# EAGLE schematic mainboard (EAGLE 9.6.2)
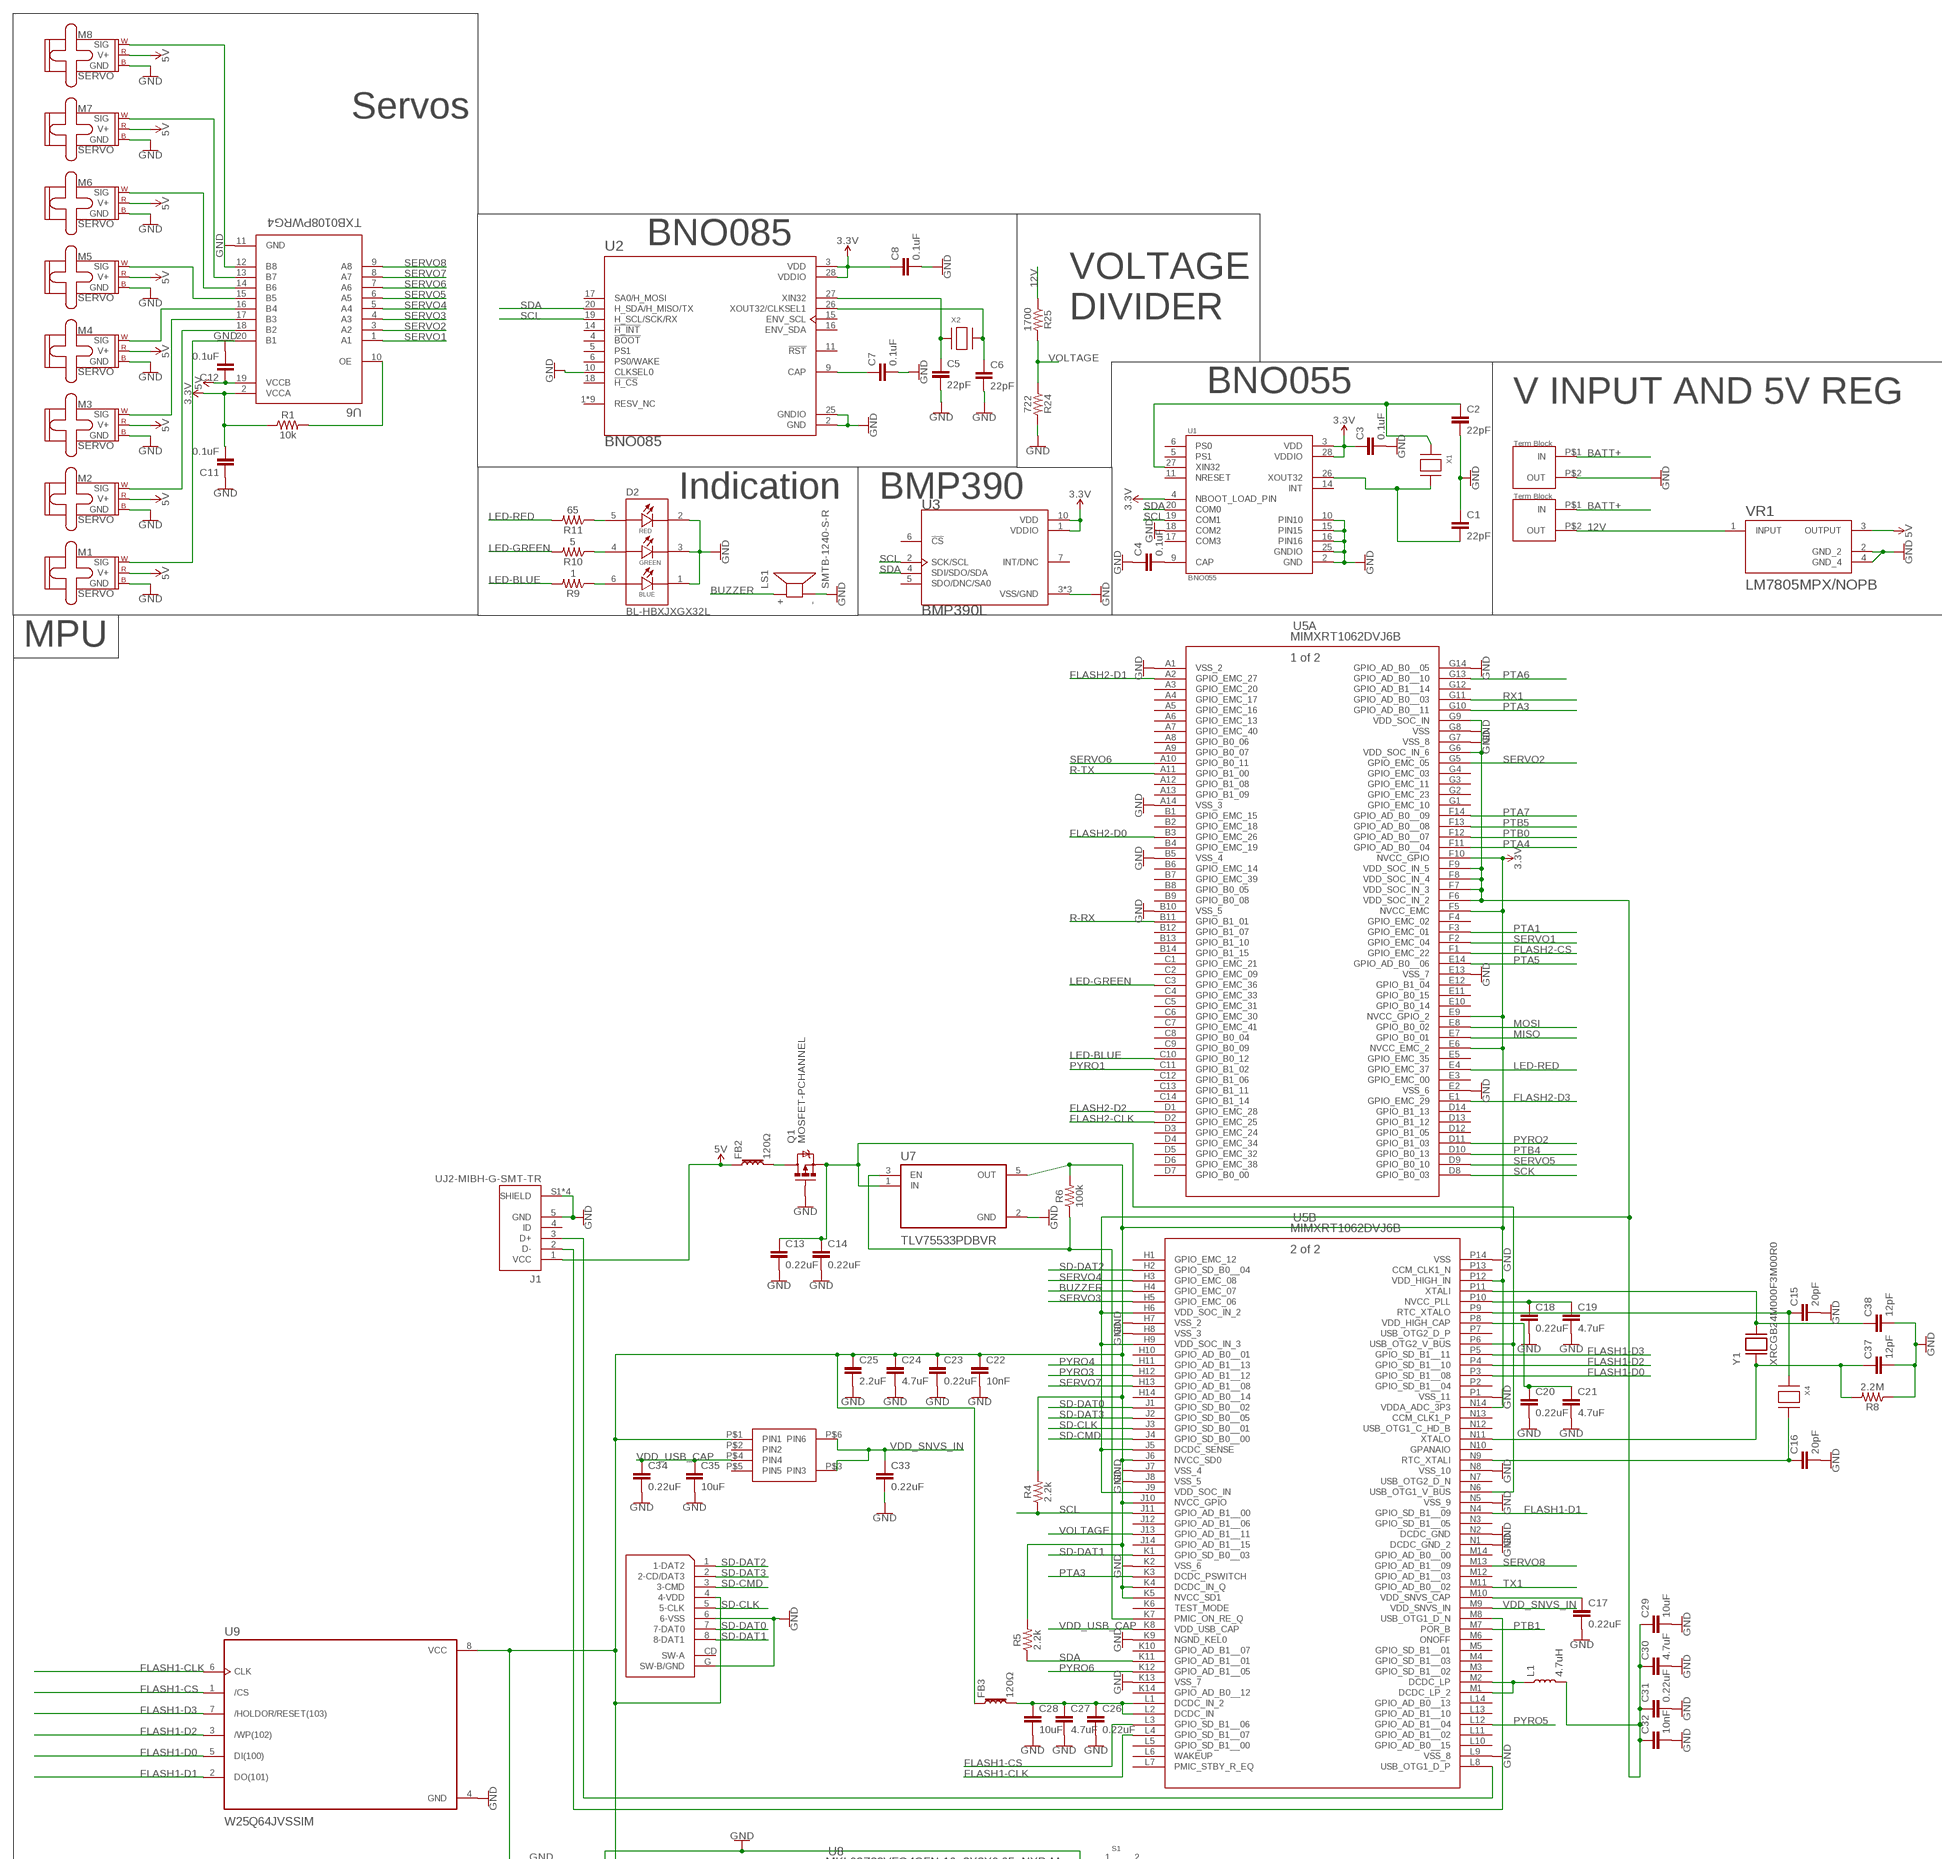
[diagram p0: schematic, sheet 1, part 1 of 3]
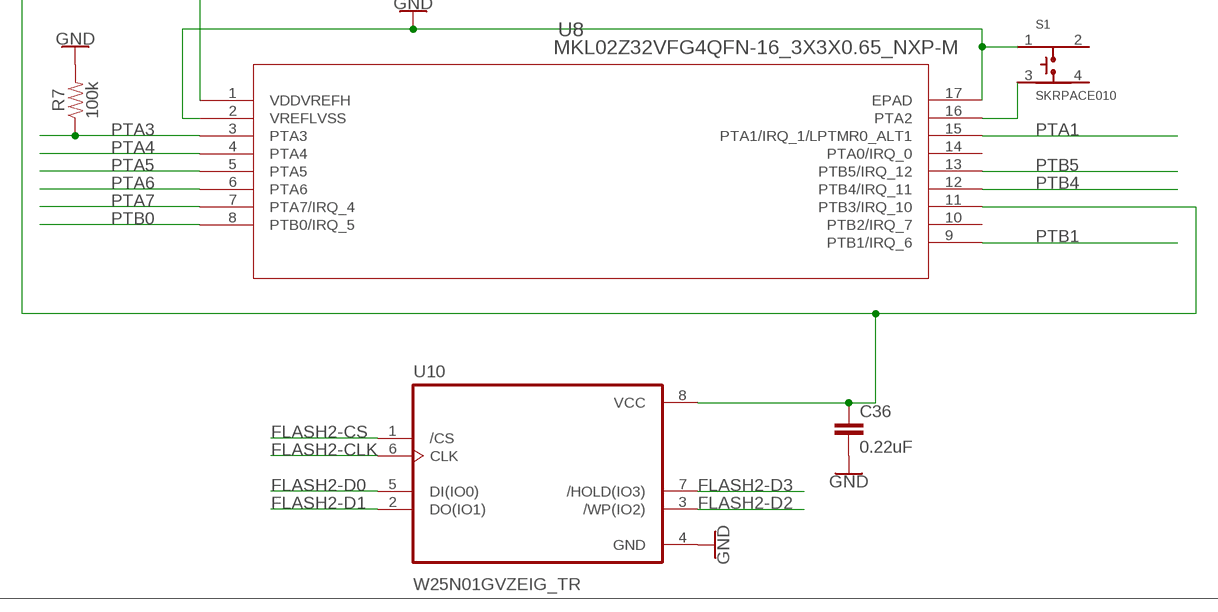
[diagram p1: schematic, sheet 1, part 2 of 3]
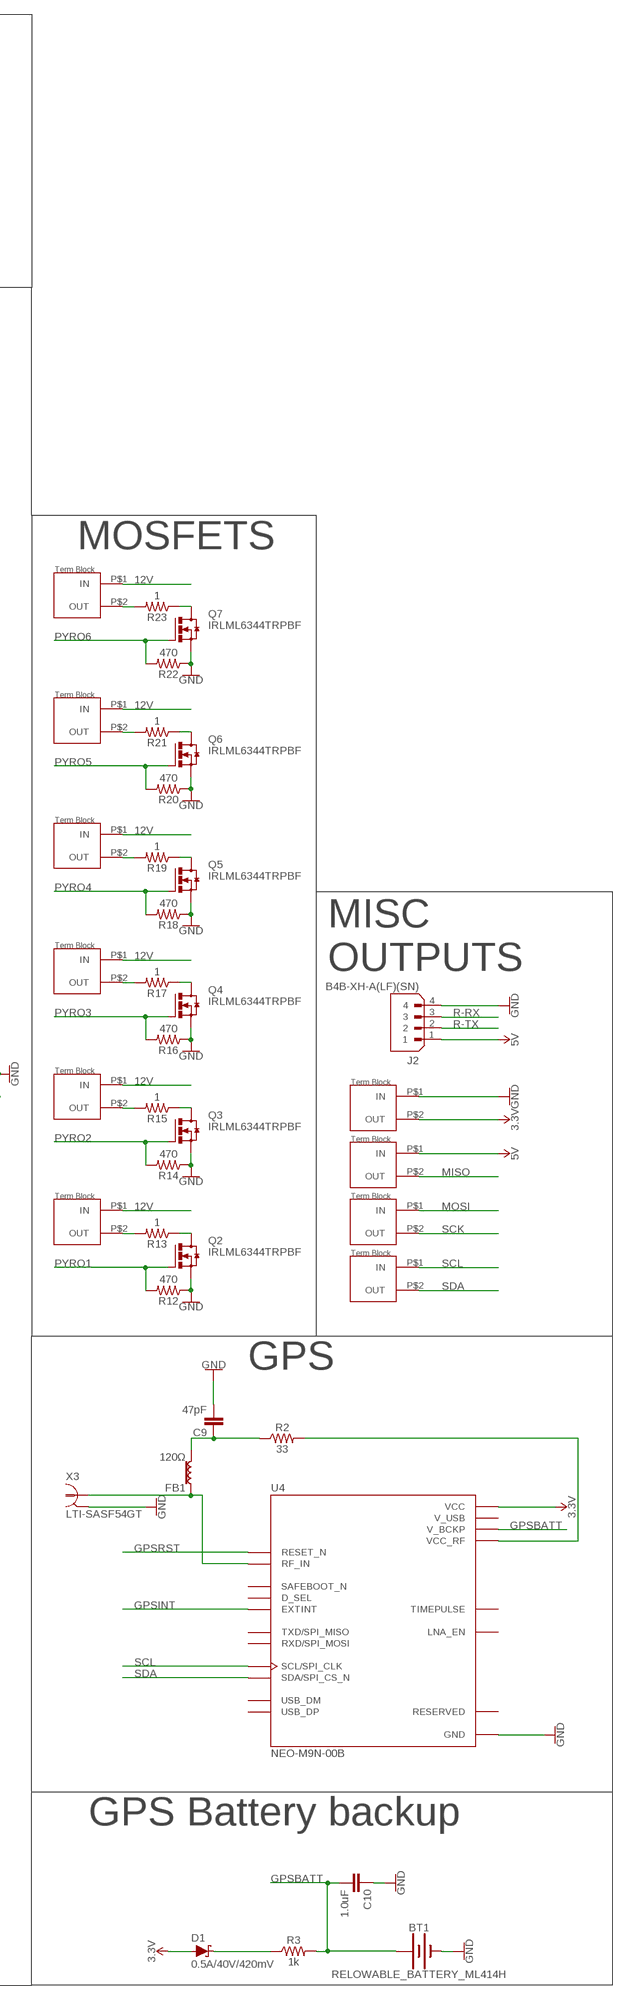
[diagram p2: schematic, sheet 1, part 3 of 3]

## Parts
BT1  RELOWABLE_BATTERY_ML414H  [ML414H_IV01E]
C1  22pF  1.0UF-0805-25V-10%  [0805]
C2  22pF  1.0UF-0805-25V-10%  [0805]
C3  0.1uF  1.0UF-0805-25V-10%  [0805]
C4  0.1uF  1.0UF-0805-25V-10%  [0805]
C5  22pF  1.0UF-0805-25V-10%  [0805]
C6  22pF  1.0UF-0805-25V-10%  [0805]
C7  0.1uF  1.0UF-0805-25V-10%  [0805]
C8  0.1uF  1.0UF-0805-25V-10%  [0805]
C9  47pF  1.0UF-0805-25V-10%  [0805]
C10  1.0uF  1.0UF-0805-25V-10%  [0805]
C11  0.1uF  1.0UF-0805-25V-10%  [0805]
C12  0.1uF  1.0UF-0805-25V-10%  [0805]
C13  0.22uF  1.0UF-0805-25V-10%  [0805]
C14  0.22uF  1.0UF-0805-25V-10%  [0805]
C15  20pF  1.0UF-0805-25V-10%  [0805]
C16  20pF  1.0UF-0805-25V-10%  [0805]
C17  0.22uF  1.0UF-0805-25V-10%  [0805]
C18  0.22uF  1.0UF-0805-25V-10%  [0805]
C19  4.7uF  1.0UF-0805-25V-10%  [0805]
C20  0.22uF  1.0UF-0805-25V-10%  [0805]
C21  4.7uF  1.0UF-0805-25V-10%  [0805]
C22  10nF  1.0UF-0805-25V-10%  [0805]
C23  0.22uF  1.0UF-0805-25V-10%  [0805]
C24  4.7uF  1.0UF-0805-25V-10%  [0805]
C25  2.2uF  1.0UF-0805-25V-10%  [0805]
C26  0.22uF  1.0UF-0805-25V-10%  [0805]
C27  4.7uF  1.0UF-0805-25V-10%  [0805]
C28  10uF  1.0UF-0805-25V-10%  [0805]
C29  10uF  1.0UF-0805-25V-10%  [0805]
C30  4.7uF  1.0UF-0805-25V-10%  [0805]
C31  0.22uF  1.0UF-0805-25V-10%  [0805]
C32  10nF  1.0UF-0805-25V-10%  [0805]
C33  0.22uF  1.0UF-0805-25V-10%  [0805]
C34  0.22uF  1.0UF-0805-25V-10%  [0805]
C35  10uF  1.0UF-0805-25V-10%  [0805]
C36  0.22uF  1.0UF-0805-25V-10%  [0805]
C37  12pF  1.0UF-0805-25V-10%  [0805]
C38  12pF  1.0UF-0805-25V-10%  [0805]
D1  0.5A/40V/420mV  DIODE-SCHOTTKY-PMEG4005EJ  [SOD-323]
D2  BL-HBXJXGX32L  [LED_BL-HBXJXGX32L]
FB1  120Ω  FERRITE_BEAD-0805-220Ω-100MHZ-2A  [0805]
FB2  120Ω  FERRITE_BEAD-0805-220Ω-100MHZ-2A  [0805]
FB3  120Ω  FERRITE_BEAD-0805-220Ω-100MHZ-2A  [0805]
J1  UJ2-MIBH-G-SMT-TR  [CUI_UJ2-MIBH-G-SMT-TR]
J2  B4B-XH-A(LF)(SN)  [JST_B4B-XH-A(LF)(SN)]
K1  112J-TDAR-R01  [112J-TDAR-R01]
L1  4.7uH  INDUCTOR-0805_WIDE-2.2UH  [0805-WIDE]
LS1  SMTB-1240-S-R  [XDCR_SMTB-1240-S-R]
M1  SERVO  [1X03]
M2  SERVO  [1X03]
M3  SERVO  [1X03]
M4  SERVO  [1X03]
M5  SERVO  [1X03]
M6  SERVO  [1X03]
M7  SERVO  [1X03]
M8  SERVO  [1X03]
Q1  MOSFET-PCHANNEL  [SOT23-3]
Q2  IRLML6344TRPBF  [SOT23]
Q3  IRLML6344TRPBF  [SOT23]
Q4  IRLML6344TRPBF  [SOT23]
Q5  IRLML6344TRPBF  [SOT23]
Q6  IRLML6344TRPBF  [SOT23]
Q7  IRLML6344TRPBF  [SOT23]
R1  10k  0.3OHM-0805-1/8W-1%  [0805]
R2  33  0.3OHM-0805-1/8W-1%  [0805]
R3  1k  0.3OHM-0805-1/8W-1%  [0805]
R4  2.2k  0.3OHM-0805-1/8W-1%  [0805]
R5  2.2k  0.3OHM-0805-1/8W-1%  [0805]
R6  100k  0.3OHM-0805-1/8W-1%  [0805]
R7  100k  0.3OHM-0805-1/8W-1%  [0805]
R8  2.2M  0.3OHM-0805-1/8W-1%  [0805]
R9  1  0.3OHM-0805-1/8W-1%  [0805]
R10  5  0.3OHM-0805-1/8W-1%  [0805]
R11  65  0.3OHM-0805-1/8W-1%  [0805]
R12  470  0.3OHM-0805-1/8W-1%  [0805]
R13  1  0.3OHM-0805-1/8W-1%  [0805]
R14  470  0.3OHM-0805-1/8W-1%  [0805]
R15  1  0.3OHM-0805-1/8W-1%  [0805]
R16  470  0.3OHM-0805-1/8W-1%  [0805]
R17  1  0.3OHM-0805-1/8W-1%  [0805]
R18  470  0.3OHM-0805-1/8W-1%  [0805]
R19  1  0.3OHM-0805-1/8W-1%  [0805]
R20  470  0.3OHM-0805-1/8W-1%  [0805]
R21  1  0.3OHM-0805-1/8W-1%  [0805]
R22  470  0.3OHM-0805-1/8W-1%  [0805]
R23  1  0.3OHM-0805-1/8W-1%  [0805]
R24  722  0.3OHM-0805-1/8W-1%  [0805]
R25  1700  0.3OHM-0805-1/8W-1%  [0805]
S1  SKRPACE010  [SW_SKRPACE010]
U1  BNO055  [LGA28R50P4X10_380X520X100]
U2  BNO085  [IC_BNO085]
U3  BMP390L  [XDCR_BMP390L]
U4  NEO-M9N-00B  [XCVR_NEO-M9N-00B]
U5  MIMXRT1062DVJ6B  [BGA196_MIMXRT_NXP]
U6  TXB0108PWRG4  [SOP65P640X120-20N]
U7  TLV75533PDBVR  [SOT95P280X145-5N]
U8  MKL02Z32VFG4QFN-16_3X3X0.65_NXP-M  [QFN-16_3X3X0.65_NXP-M]
U9  W25Q64JVSSIM  [SOIC127P790X216-8N]
U10  W25N01GVZEIG_TR  [SON127P800X600X80-9N]
U$1  BAT54CTB6  [BAT54CTB6]
U$2  AK100  [AK100]
U$3  AK100  [AK100]
U$4  AK100  [AK100]
U$5  AK100  [AK100]
U$6  AK100  [AK100]
U$7  AK100  [AK100]
U$8  AK100  [AK100]
U$9  AK100  [AK100]
U$10  AK100  [AK100]
U$11  AK100  [AK100]
U$12  AK100  [AK100]
U$13  AK100  [AK100]
VR1  LM7805MPX/NOPB  [VREG_LM7805MPX/NOPB]
X1  XTAL-3.2X1.5  [XTAL3215]
X2  XTAL-3.2X1.5  [XTAL3215]
X3  LTI-SASF54GT  [LTI-SASF54GT]
X4  XTAL-3.2X1.5  [XTAL3215]
Y1  XRCGB24M000F3M00R0  [OSC_XRCGB24M000F3M00R0]

## Nets
3.3V: C3.1 C8.1 C11.2 C22.1 C23.1 C24.1 C25.1 C36.1 D1.A FB3.1 K1.4(4-VDD) R1.1 R4.2 R5.2 R6.2 U1.3(VDD) U1.4(NBOOT_LOAD_PIN) U1.28(VDDIO) U2.3(VDD) U2.28(VDDIO) U3.1(VDDIO) U3.10(VDD) U4.23(VCC) U5.E6(A:NVCC_EMC_2) U5.E9(A:NVCC_GPIO_2) U5.F5(A:NVCC_EMC) U5.F10(A:NVCC_GPIO) U5.J6(B:NVCC_SD0) U5.J10(B:NVCC_GPIO) U5.K4(B:DCDC_IN_Q) U5.K5(B:NVCC_SD1) U5.N14(B:VDDA_ADC_3P3) U5.P12(B:VDD_HIGH_IN) U6.2(VCCA) U7.5(OUT) U8.1(VDDVREFH) U8.11(PTB3/IRQ_10) U9.8(VCC) U10.8(VCC) U$1.P$1(PIN1) U$11.P$2(OUT)
5V: C12.1 FB2.1 J1.1(VCC) J2.1 M1.2(V+) M2.2(V+) M3.2(V+) M4.2(V+) M5.2(V+) M6.2(V+) M7.2(V+) M8.2(V+) U6.19(VCCB) U$10.P$1(IN) VR1.3(OUTPUT)
12V: R25.1 U$2.P$1(IN) U$3.P$1(IN) U$4.P$1(IN) U$5.P$1(IN) U$6.P$1(IN) U$8.P$1(IN) U$13.P$2(OUT) VR1.1(INPUT)
BATT+: U$12.P$1(IN) U$13.P$1(IN)
BUZZER: LS1.P(+) U5.H4(B:GPIO_EMC_07)
FLASH1-CLK: U5.L4(B:GPIO_SD_B1__07) U9.6(CLK)
FLASH1-CS: U5.L3(B:GPIO_SD_B1__06) U9.1(/CS)
FLASH1-D0: U5.P3(B:GPIO_SD_B1__08) U9.5(DI(100))
FLASH1-D1: U5.N4(B:GPIO_SD_B1__09) U9.2(DO(101))
FLASH1-D2: U5.P4(B:GPIO_SD_B1__10) U9.3(/WP(102))
FLASH1-D3: U5.P5(B:GPIO_SD_B1__11) U9.7(/HOLDOR/RESET(103))
FLASH2-CLK: U5.D2(A:GPIO_EMC_25) U10.6(CLK)
FLASH2-CS: U5.F1(A:GPIO_EMC_22) U10.1(/CS)
FLASH2-D0: U5.B3(A:GPIO_EMC_26) U10.5(DI(IO0))
FLASH2-D1: U5.A2(A:GPIO_EMC_27) U10.2(DO(IO1))
FLASH2-D2: U5.D1(A:GPIO_EMC_28) U10.3(/WP(IO2))
FLASH2-D3: U5.E1(A:GPIO_EMC_29) U10.7(/HOLD(IO3))
GND: BT1.- C1.1 C2.2 C3.2 C4.1 C5.2 C6.2 C7.2 C8.2 C9.2 C10.1 C11.1 C12.2 C13.2 C14.2 C15.2 C16.2 C17.2 C18.2 C19.2 C20.2 C21.2 C22.2 C23.2 C24.2 C25.2 C26.2 C27.2 C28.2 C29.2 C30.2 C31.2 C32.2 C33.2 C34.2 C35.2 C36.2 C37.2 C38.2 D2.1(B_C) D2.2(R_C) D2.3(G_C) J1.5(GND) J1.S1(SHIELD) J1.S2(SHIELD) J1.S3(SHIELD) J1.S4(SHIELD) J2.4 K1.6(6-VSS) K1.G(SW-B/GND) LS1.N(-) M1.3(GND) M2.3(GND) M3.3(GND) M4.3(GND) M5.3(GND) M6.3(GND) M7.3(GND) M8.3(GND) Q1.1(G) Q2.2(S) Q3.2(S) Q4.2(S) Q5.2(S) Q6.2(S) Q7.2(S) R7.2 R8.1 R12.1 R14.1 R16.1 R18.1 R20.1 R22.1 R24.2 S1.1 U1.2(GND) U1.10(PIN10) U1.15(PIN15) U1.16(PIN16) U1.18(COM2) U1.25(GNDIO) U2.2(GND) U2.10(CLKSEL0) U2.25(GNDIO) U3.3(VSS/GND) U3.8(VSS/GND) U3.9(VSS/GND) U4.10(GND) U4.12(GND) U4.13(GND) U4.24(GND) U5.A1(A:VSS_2) U5.A14(A:VSS_3) U5.B5(A:VSS_4) U5.B10(A:VSS_5) U5.E2(A:VSS_6) U5.E13(A:VSS_7) U5.G7(A:VSS_8) U5.G8(A:VSS) U5.G14(A:GPIO_AD_B0__05) U5.H7(B:VSS_2) U5.H8(B:VSS_3) U5.J7(B:VSS_4) U5.J8(B:VSS_5) U5.K2(B:VSS_6) U5.K9(B:NGND_KEL0) U5.K13(B:VSS_7) U5.L9(B:VSS_8) U5.N1(B:DCDC_GND_2) U5.N2(B:DCDC_GND) U5.N5(B:VSS_9) U5.N8(B:VSS_10) U5.P1(B:VSS_11) U5.P14(B:VSS) U6.11(GND) U7.2(GND) U8.2(VREFLVSS) U8.17(EPAD) U9.4(GND) U10.4(GND) U$11.P$1(IN) U$12.P$2(OUT) VR1.2(GND_2) VR1.4(GND_4) X3.2 X3.3 X3.4 X3.5
GPSBATT: BT1.+ C10.2 R3.2 U4.22(V_BCKP)
GPSINT: U4.4(EXTINT)
GPSRST: U4.8(RESET_N)
LED-BLUE: R9.2 U5.C10(A:GPIO_B0_12)
LED-GREEN: R10.2 U5.C3(A:GPIO_EMC_36)
LED-RED: R11.2 U5.E4(A:GPIO_EMC_37)
MISO: U5.E7(A:GPIO_B0_01) U$10.P$2(OUT)
MOSI: U5.E8(A:GPIO_B0_02) U$9.P$1(IN)
N$1: C2.1 U1.27(XIN32) X1.P$1
N$2: C1.2 U1.26(XOUT32) X1.P$2
N$3: C4.2 U1.9(CAP)
N$4: C5.1 U2.27(XIN32) X2.P$1
N$5: C6.1 U2.26(XOUT32/CLKSEL1) X2.P$2
N$6: C7.1 U2.9(CAP)
N$8: FB1.1 U4.11(RF_IN) X3.1
N$9: R2.2 U4.9(VCC_RF)
N$10: C9.1 FB1.2 R2.1
N$11: D1.C R3.1
N$12: C16.1 U5.N9(B:RTC_XTALI) X4.P$2
N$13: R6.1 U5.K7(B:PMIC_ON_RE_Q) U7.3(EN)
N$14: M8.1(SIG) U6.12(B8)
N$15: M7.1(SIG) U6.13(B7)
N$16: M6.1(SIG) U6.14(B6)
N$17: M5.1(SIG) U6.15(B5)
N$18: M1.1(SIG) U6.20(B1)
N$19: M2.1(SIG) U6.18(B2)
N$20: M3.1(SIG) U6.17(B3)
N$21: M4.1(SIG) U6.16(B4)
N$22: R1.2 U6.10(OE)
N$23: J1.2(D-) U5.M8(B:USB_OTG1_D_N)
N$24: J1.3(D+) U5.L8(B:USB_OTG1_D_P)
N$25: FB2.2 Q1.3(D)
N$26: C15.1 U5.P9(B:RTC_XTALO) X4.P$1
N$27: C13.1 C14.1 Q1.2(S) U5.N6(B:USB_OTG1_V_BUS) U5.P6(B:USB_OTG2_V_BUS) U7.1(IN)
N$28: C26.1 C27.1 C28.1 FB3.2 U5.L1(B:DCDC_IN_2) U5.L2(B:DCDC_IN)
N$29: L1.1 U5.M1(B:DCDC_LP_2) U5.M2(B:DCDC_LP)
N$30: C29.1 C30.1 C31.1 C32.1 L1.2 U5.F6(A:VDD_SOC_IN_2) U5.F7(A:VDD_SOC_IN_3) U5.F8(A:VDD_SOC_IN_4) U5.F9(A:VDD_SOC_IN_5) U5.G6(A:VDD_SOC_IN_6) U5.G9(A:VDD_SOC_IN) U5.H6(B:VDD_SOC_IN_2) U5.H9(B:VDD_SOC_IN_3) U5.J5(B:DCDC_SENSE) U5.J9(B:VDD_SOC_IN)
N$31: C17.1 U5.M10(B:VDD_SNVS_CAP)
N$32: C20.1 C21.1 U5.P8(B:VDD_HIGH_CAP)
N$33: C18.1 C19.1 U5.P10(B:NVCC_PLL)
N$34: S1.3 U8.16(PTA2)
N$35: C37.1 R8.2 U5.N11(B:XTALO) Y1.1
N$36: C38.1 U5.P11(B:XTALI) Y1.3
N$37: D2.6(B_A) R9.1
N$38: D2.4(G_A) R10.1
N$39: D2.5(R_A) R11.1
N$41: Q2.3(D) R13.1
N$42: R13.2 U$8.P$2(OUT)
N$44: Q3.3(D) R15.1
N$45: R15.2 U$2.P$2(OUT)
N$47: Q4.3(D) R17.1
N$48: R17.2 U$3.P$2(OUT)
N$50: Q5.3(D) R19.1
N$51: R19.2 U$4.P$2(OUT)
N$53: Q6.3(D) R21.1
N$54: R21.2 U$5.P$2(OUT)
N$56: Q7.3(D) R23.1
N$57: R23.2 U$6.P$2(OUT)
PTA1: U5.F3(A:GPIO_EMC_01) U8.15(PTA1/IRQ_1/LPTMR0_ALT1)
PTA3: R7.1 U5.G10(A:GPIO_AD_B0__11) U5.K3(B:DCDC_PSWITCH) U8.3(PTA3)
PTA4: U5.F11(A:GPIO_AD_B0__04) U8.4(PTA4)
PTA5: U5.E14(A:GPIO_AD_B0__06) U8.5(PTA5)
PTA6: U5.G13(A:GPIO_AD_B0__10) U8.6(PTA6)
PTA7: U5.F14(A:GPIO_AD_B0__09) U8.7(PTA7/IRQ_4)
PTB0: U5.F12(A:GPIO_AD_B0__07) U8.8(PTB0/IRQ_5)
PTB1: U5.M7(B:POR_B) U8.9(PTB1/IRQ_6)
PTB4: U5.D10(A:GPIO_B0_13) U8.12(PTB4/IRQ_11)
PTB5: U5.F13(A:GPIO_AD_B0__08) U8.13(PTB5/IRQ_12)
PYRO1: Q2.1(G) R12.2 U5.C11(A:GPIO_B1_02)
PYRO2: Q3.1(G) R14.2 U5.D11(A:GPIO_B1_03)
PYRO3: Q4.1(G) R16.2 U5.H12(B:GPIO_AD_B1__12)
PYRO4: Q5.1(G) R18.2 U5.H11(B:GPIO_AD_B1__13)
PYRO5: Q6.1(G) R20.2 U5.L12(B:GPIO_AD_B1__04)
PYRO6: Q7.1(G) R22.2 U5.K12(B:GPIO_AD_B1__05)
R-RX: J2.3 U5.B11(A:GPIO_B1_01)
R-TX: J2.2 U5.A11(A:GPIO_B1_00)
RX1: U5.G11(A:GPIO_AD_B0__03)
SCK: U5.D8(A:GPIO_B0_03) U$9.P$2(OUT)
SCL: R4.1 U1.19(COM1) U2.19(H_SCL/SCK/RX) U3.2(SCK/SCL) U4.19(SCL/SPI_CLK) U5.J11(B:GPIO_AD_B1__00) U$7.P$1(IN)
SD-CLK: K1.5(5-CLK) U5.J3(B:GPIO_SD_B0__01)
SD-CMD: K1.3(3-CMD) U5.J4(B:GPIO_SD_B0__00)
SD-DAT0: K1.7(7-DAT0) U5.J1(B:GPIO_SD_B0__02)
SD-DAT1: K1.8(8-DAT1) U5.K1(B:GPIO_SD_B0__03)
SD-DAT2: K1.1(1-DAT2) U5.H2(B:GPIO_SD_B0__04)
SD-DAT3: K1.2(2-CD/DAT3) U5.J2(B:GPIO_SD_B0__05)
SDA: R5.1 U1.20(COM0) U2.20(H_SDA/H_MISO/TX) U3.4(SDI/SDO/SDA) U4.18(SDA/SPI_CS_N) U5.K11(B:GPIO_AD_B1__01) U$7.P$2(OUT)
SERVO1: U5.F2(A:GPIO_EMC_04) U6.1(A1)
SERVO2: U5.G5(A:GPIO_EMC_05) U6.3(A2)
SERVO3: U5.H5(B:GPIO_EMC_06) U6.4(A3)
SERVO4: U5.H3(B:GPIO_EMC_08) U6.5(A4)
SERVO5: U5.D9(A:GPIO_B0_10) U6.6(A5)
SERVO6: U5.A10(A:GPIO_B0_11) U6.7(A6)
SERVO7: U5.H13(B:GPIO_AD_B1__08) U6.8(A7)
SERVO8: U5.M13(B:GPIO_AD_B1__09) U6.9(A8)
TX1: U5.M11(B:GPIO_AD_B0__02)
VDD_SNVS_IN: C33.1 U5.M9(B:VDD_SNVS_IN) U$1.P$3(PIN3) U$1.P$6(PIN6)
VDD_USB_CAP: C34.1 C35.1 U5.K8(B:VDD_USB_CAP) U$1.P$4(PIN4)
VOLTAGE: R24.1 R25.2 U5.J13(B:GPIO_AD_B1__11)
Unconnected: J1.4(ID) K1.CD(SW-A) S1.2 S1.4 U1.5(PS1) U1.6(PS0) U1.11(NRESET) U1.14(INT) U1.17(COM3) U2.1(RESV_NC) U2.4(!BOOT) U2.5(PS1) U2.6(PS0/WAKE) U2.7(RESV_NC) U2.8(RESV_NC) U2.11(!RST) U2.12(RESV_NC) U2.13(RESV_NC) U2.14(!H_INT) U2.15(ENV_SCL) U2.16(ENV_SDA) U2.17(SA0/H_MOSI) U2.18(!H_CS) U2.21(RESV_NC) U2.22(RESV_NC) U2.23(RESV_NC) U2.24(RESV_NC) U3.5(SDO/DNC/SA0) U3.6(!CS) U3.7(INT/DNC) U4.1(SAFEBOOT_N) U4.2(D_SEL) U4.3(TIMEPULSE) U4.5(USB_DM) U4.6(USB_DP) U4.14(LNA_EN) U4.15(RESERVED) U4.16(RESERVED) U4.17(RESERVED) U4.20(TXD/SPI_MISO) U4.21(RXD/SPI_MOSI) U5.A3(A:GPIO_EMC_20) U5.A4(A:GPIO_EMC_17) U5.A5(A:GPIO_EMC_16) U5.A6(A:GPIO_EMC_13) U5.A7(A:GPIO_EMC_40) U5.A8(A:GPIO_B0_06) U5.A9(A:GPIO_B0_07) U5.A12(A:GPIO_B1_08) U5.A13(A:GPIO_B1_09) U5.B1(A:GPIO_EMC_15) U5.B2(A:GPIO_EMC_18) U5.B4(A:GPIO_EMC_19) U5.B6(A:GPIO_EMC_14) U5.B7(A:GPIO_EMC_39) U5.B8(A:GPIO_B0_05) U5.B9(A:GPIO_B0_08) U5.B12(A:GPIO_B1_07) U5.B13(A:GPIO_B1_10) U5.B14(A:GPIO_B1_15) U5.C1(A:GPIO_EMC_21) U5.C2(A:GPIO_EMC_09) U5.C4(A:GPIO_EMC_33) U5.C5(A:GPIO_EMC_31) U5.C6(A:GPIO_EMC_30) U5.C7(A:GPIO_EMC_41) U5.C8(A:GPIO_B0_04) U5.C9(A:GPIO_B0_09) U5.C12(A:GPIO_B1_06) U5.C13(A:GPIO_B1_11) U5.D4(A:GPIO_EMC_34) U5.D5(A:GPIO_EMC_32) U5.D6(A:GPIO_EMC_38) U5.D7(A:GPIO_B0_00) U5.D13(A:GPIO_B1_12) U5.D14(A:GPIO_B1_13) U5.E3(A:GPIO_EMC_00) U5.E5(A:GPIO_EMC_35) U5.E10(A:GPIO_B0_14) U5.E11(A:GPIO_B0_15) U5.E12(A:GPIO_B1_04) U5.F4(A:GPIO_EMC_02) U5.G1(A:GPIO_EMC_10) U5.G2(A:GPIO_EMC_23) U5.G3(A:GPIO_EMC_11) U5.G4(A:GPIO_EMC_03) U5.G12(A:GPIO_AD_B1__14) U5.H1(B:GPIO_EMC_12) U5.H14(B:GPIO_AD_B0__14) U5.J12(B:GPIO_AD_B1__06) U5.J14(B:GPIO_AD_B1__15) U5.K6(B:TEST_MODE) U5.K10(B:GPIO_AD_B1__07) U5.K14(B:GPIO_AD_B0__12) U5.L5(B:GPIO_SD_B1__00) U5.L6(B:WAKEUP) U5.L7(B:PMIC_STBY_R_EQ) U5.L10(B:GPIO_AD_B0__15) U5.L11(B:GPIO_AD_B1__02) U5.L13(B:GPIO_AD_B1__10) U5.L14(B:GPIO_AD_B0__13) U5.M3(B:GPIO_SD_B1__02) U5.M4(B:GPIO_SD_B1__03) U5.M5(B:GPIO_SD_B1__01) U5.M6(B:ONOFF) U5.M12(B:GPIO_AD_B1__03) U5.M14(B:GPIO_AD_B0__00) U5.N3(B:GPIO_SD_B1__05) U5.N7(B:USB_OTG2_D_N) U5.N10(B:GPANAIO) U5.N12(B:USB_OTG1_C_HD_B) U5.N13(B:CCM_CLK1_P) U5.P2(B:GPIO_SD_B1__04) U5.P7(B:USB_OTG2_D_P) U5.P13(B:CCM_CLK1_N) U8.10(PTB2/IRQ_7) U8.14(PTA0/IRQ_0) U$1.P$2(PIN2) U$1.P$5(PIN5)

## Notes on the sheet
- Servos
- BNO085
- VOLTAGE
  DIVIDER
- BNO055 | V INPUT AND 5V REG
- Indication | BMP390
- MPU
- MOSFETS
- MISC
  OUTPUTS
- GPS
- GPS Battery backup

## Power pins joined to a net without a drawn wire
GPIO_AD_B0__01: U5.H10(B:GPIO_AD_B0__01)
GPIO_B1_05: U5.D12(A:GPIO_B1_05)
GPIO_B1_14: U5.C14(A:GPIO_B1_14)
GPIO_EMC_24: U5.D3(A:GPIO_EMC_24)
V_USB: U4.7(V_USB)

## Library data of the parts
BT1 = SparkFun-Batteries:RELOWABLE_BATTERY: SEIKO Reflowable Lithium Batteries; PROD_ID: BATT-14267
C1-C9 C11-C38 = SparkFun-Capacitors:1.0UF: 1µF ceramic capacitors A capacitor is a passive two-terminal electrical component used to store electrical energy temporarily in an electric field.; PROD_ID: CAP-08064; VALUE: 1.0uF
C10 = SparkFun-Capacitors:1.0UF: 1µF ceramic capacitors A capacitor is a passive two-terminal electrical component used to store electrical energy temporarily in an electric field.; PROD_ID: CAP-08064
D1 = SparkFun-DiscreteSemi:DIODE-SCHOTTKY: Schottky diode A Schottky diode is a semiconductor diode which has a low forward voltage drop and a very fast switching action.; PROD_ID: DIO-10955
D2 = BL-HBXJXGX32L:BL-HBXJXGX32L: Check availability <https://pricing.snapeda.com/parts/BL-HBXJXGX32L/American%20Bright%20Optoelectronics%20Corporation/view-part?ref=eda>; AVAILABILITY: In Stock; CHECK_PRICES: https://www.snapeda.com/parts/BL-HBXJXGX32L/American+Bright+Optoelectronics/view-part/?ref=eda; DESCRIPTION: Red, Green, Blue (RGB) 625nm Red, 525nm Green, 568nm Blue LED Indication - Discrete 2V Red, 3.2V Green, 3.3V Blue 6-SMD, J-Lead; MF: American Bright Optoelectronics Corporation; MP: BL-HBXJXGX32L; PACKAGE: SMD-6 American Bright Optoelectronics; PRICE: None; SNAPEDA_LINK: https://www.snapeda.com/parts/BL-HBXJXGX32L/American+Bright+Optoelectronics/view-part/?ref=snap
FB1-FB3 = SparkFun-Coils:FERRITE_BEAD: Ferrite Bead (blocks, cores, rings, chokes, etc.) Inductor with layers of ferrite used to suppress high frequencies. Often used to isolate high frequency noise. SparkFun Products: IOIO-OTG - V2.2 <https://www.sparkfun.com/products/13613> SparkFun SAMD21 Mini Breakout <https://www.sparkfun.com/products/13664> SparkFun 6 Degrees of Freedom Breakout - LSM6DS3 <https://www.sparkfun.com/products/13339> SparkFun SAMD21 Dev Breakout <https://www.sparkfun.com/products/13672> Lilypad MP3 <https://www.sparkfun.com/products/11013>; PROD_ID: NDUC-10201; VALUE: 220Ω
J1 = UJ2-MIBH-G-SMT-TR:UJ2-MIBH-G-SMT-TR: Check availability <https://pricing.snapeda.com/parts/UJ2-MIBH-G-SMT-TR/Same%20Sky/view-part?ref=eda>; AVAILABILITY: In Stock; CHECK_PRICES: https://www.snapeda.com/parts/UJ2-MIBH-G-SMT-TR/Same+Sky/view-part/?ref=eda; DESCRIPTION: Micro B, USB 2.0, 480 Mbps, 5 Vdc, 1.8 A, Right Angle, Surface Mount, Black Insulator, USB Receptacle; MF: Same Sky; MP: UJ2-MIBH-G-SMT-TR; PACKAGE: None; PRICE: None; SNAPEDA_LINK: https://www.snapeda.com/parts/UJ2-MIBH-G-SMT-TR/Same+Sky/view-part/?ref=snap
J2 = B4B-XH-A_LF__SN_:B4B-XH-A(LF)(SN): Check availability <https://pricing.snapeda.com/parts/B4B-XH-A%20%28LF%29%28SN%29/JST%20Sales/view-part?ref=eda>; AVAILABILITY: In Stock; CHECK_PRICES: https://www.snapeda.com/parts/B4B-XH-A%20(LF)(SN)/JST/view-part/?ref=eda; DESCRIPTION: Connector Header Through Hole 4 position 0.098 (2.50mm); MF: JST Sales; MP: B4B-XH-A (LF)(SN); PACKAGE: None; PRICE: None; SNAPEDA_LINK: https://www.snapeda.com/parts/B4B-XH-A%20(LF)(SN)/JST/view-part/?ref=snap
K1 = 112J-TDAR-R01:112J-TDAR-R01: Check availability <https://pricing.snapeda.com/parts/112J-TDAR-R01/Attend/view-part?ref=eda>; AVAILABILITY: In Stock; CHECK_PRICES: https://www.snapeda.com/parts/112J-TDAR-R01/Attend/view-part/?ref=eda; DESCRIPTION: 9 (8 + 1) Position Card Connector Secure Digital - microSD™ Surface Mount, Right Angle Gold; MF: Attend; MP: 112J-TDAR-R01; PACKAGE: None; PRICE: None; SNAPEDA_LINK: https://www.snapeda.com/parts/112J-TDAR-R01/Attend/view-part/?ref=snap
L1 = SparkFun-Coils:INDUCTOR: Inductors Resist changes in electrical current. Basically a coil of wire. SparkFun Products: SparkFun Load Cell Amplifier - HX711 <https://www.sparkfun.com/products/13879> IOIO-OTG - V2.2 <https://www.sparkfun.com/products/13613>; PROD_ID: NDUC-14234; VALUE: 2.2uH
LS1 = SMTB-1240-S-R:SMTB-1240-S-R: Check availability <https://pricing.snapeda.com/parts/SMTB-1240-S-R/PUI%20Audio/view-part?ref=eda>; AVAILABILITY: In Stock; CHECK_PRICES: https://www.snapeda.com/parts/SMTB-1240-S-R/PUI+Audio/view-part/?ref=eda; DESCRIPTION: 12X12MM TRANSDUCER 4000HZ 75DB; MF: PUI Audio; MP: SMTB-1240-S-R; PACKAGE: Package; PRICE: None; SNAPEDA_LINK: https://www.snapeda.com/parts/SMTB-1240-S-R/PUI+Audio/view-part/?ref=snap
M1-M8 = SparkFun-Electromechanical:SERVO: Servo Motor 3-pin connector for a standard servo motor (voltage supply, ground, and control signal.) SparkFun Products Servo - Generic (Sub-Micro Size) <https://www.sparkfun.com/products/9065> (ROB-09065) Servo - Generic High Torque Continuous Rotation (Standard Size) <https://www.sparkfun.com/products/9347> (ROB-09347) Servo - Generic High Torque (Standard Size) <https://www.sparkfun.com/products/11965> (ROB-11965)
Q1 = User-Submitted:MOSFET-PCHANNEL: Generic PMOSFET IRLML2244 - TRANS-11153 (SOT-23 -20V -4.3A) (1.Gate 2.Source 3.Drain) FQP27P06 - COM-10349 <http://www.sparkfun.com/products/10349> (TO-220 -60V -27A) (1.Gate 2.Source 3.Drain); PROD_ID: TRANS-08285
Q2-Q7 = IRLML6344TRPBF:IRLML6344TRPBF: Check availability <https://pricing.snapeda.com/parts/IRLML6344TRPBF/Infineon%20Technologies/view-part?ref=eda>; AVAILABILITY: In Stock; CHECK_PRICES: https://www.snapeda.com/parts/IRLML6344TRPBF/Infineon/view-part/?ref=eda; DESCRIPTION: IRLML6344TRPBF N-channel MOSFET Transistor, 5 A, 30 V, 3-Pin SOT-23 | Infineon IRLML6344TRPBF; MF: Infineon Technologies; MP: IRLML6344TRPBF; PACKAGE: SOT-23-3 ON Semiconductor; PRICE: None; SNAPEDA_LINK: https://www.snapeda.com/parts/IRLML6344TRPBF/Infineon/view-part/?ref=snap
R1-R25 = SparkFun-Resistors:0.3OHM: 0.3Ω resistor A resistor is a passive two-terminal electrical component that implements electrical resistance as a circuit element. Resistors act to reduce current flow, and, at the same time, act to lower voltage levels within circuits. - Wikipedia; PROD_ID: RES-11622; VALUE: 0.3
S1 = SKRPACE010:SKRPACE010: Check availability <https://pricing.snapeda.com/parts/SKRPACE010/ALPS/view-part?ref=eda>; AVAILABILITY: In Stock; CHECK_PRICES: https://www.snapeda.com/parts/SKRPACE010/ALPS/view-part/?ref=eda; DESCRIPTION: Switch Tactile N.O. SPST Button J-Bend 0.05A 16VDC 2.55N SMD Automotive T/R; MF: ALPS; MP: SKRPACE010; PACKAGE: None; PRICE: None; SNAPEDA_LINK: https://www.snapeda.com/parts/SKRPACE010/ALPS/view-part/?ref=snap
U1 = BNO055:BNO055: Check availability <https://pricing.snapeda.com/parts/BNO055/Bosch/view-part?ref=eda>; AVAILABILITY: In Stock; CHECK_PRICES: https://www.snapeda.com/parts/BNO055/Bosch/view-part/?ref=eda; DESCRIPTION: BNO055 series Accelerometer, Gyroscope, Magnetometer, 3 Axis Sensor Evaluation Board; MF: Bosch; MP: BNO055; PACKAGE: LGA-28 Bosch; PRICE: None; SNAPEDA_LINK: https://www.snapeda.com/parts/BNO055/Bosch/view-part/?ref=snap
U2 = BNO085:BNO085: Check availability <https://pricing.snapeda.com/parts/BNO085/CEVA%20Technologies%2C%20Inc./view-part?ref=eda>; AVAILABILITY: In Stock; CHECK_PRICES: https://www.snapeda.com/parts/BNO085/CEVA+Technologies%252C+Inc./view-part/?ref=eda; DESCRIPTION: Accelerometer, Gyroscope, Magnetometer, 9 Axis Sensor I2C, SPI, UART Output; MF: CEVA Technologies, Inc.; MP: BNO085; PACKAGE: None; PRICE: None; SNAPEDA_LINK: https://www.snapeda.com/parts/BNO085/CEVA+Technologies%252C+Inc./view-part/?ref=snap
U3 = BMP390L:BMP390L: Check availability <https://pricing.snapeda.com/parts/BMP390L/Bosch%20Sensortec/view-part?ref=eda>; AVAILABILITY: In Stock; CHECK_PRICES: https://www.snapeda.com/parts/BMP390L/Bosch/view-part/?ref=eda; DESCRIPTION: Pressure Sensor Development Tools Evaluation Shuttle Board for the BMP390L; MF: Bosch Sensortec; MP: BMP390L; PACKAGE: None; PRICE: None; SNAPEDA_LINK: https://www.snapeda.com/parts/BMP390L/Bosch/view-part/?ref=snap
U4 = NEO-M9N-00B:NEO-M9N-00B: Check availability <https://pricing.snapeda.com/parts/NEO-M9N-00B/u-blox/view-part?ref=eda>; AVAILABILITY: In Stock; CHECK_PRICES: https://www.snapeda.com/parts/NEO-M9N-00B/u-blox/view-part/?ref=eda; DESCRIPTION: series RF Receiver BeiDou, Galileo, GLONASS, GNSS, GPS - -167dBm - - Module; MF: u-blox; MP: NEO-M9N-00B; PACKAGE: SMD-24 u-blox; PRICE: None; SNAPEDA_LINK: https://www.snapeda.com/parts/NEO-M9N-00B/u-blox/view-part/?ref=snap
U5 = MIMXRT1062DVJ6B:MIMXRT1062DVJ6B; COPYRIGHT: Copyright (C) 2025 Ultra Librarian. All rights reserved.; MANUFACTURER_PART_NUMBER: MIMXRT1062DVJ6B; MFR_NAME: NXP
U6 = TXB0108PWRG4:TXB0108PWRG4: Check availability <https://pricing.snapeda.com/parts/TXB0108PWRG4/Texas%20Instruments/view-part?ref=eda>; AVAILABILITY: In Stock; CHECK_PRICES: https://www.snapeda.com/parts/TXB0108PWRG4/Texas+Instruments/view-part/?ref=eda; DESCRIPTION: 8-Bit Bidirectional Voltage-Level Shifter with Auto Direction Sensing and +/-15-kV ESD Protect 20-TSSOP -40 to 85; MF: Texas Instruments; MP: TXB0108PWRG4; PACKAGE: TSSOP-20 Texas Instruments; PRICE: None; SNAPEDA_LINK: https://www.snapeda.com/parts/TXB0108PWRG4/Texas+Instruments/view-part/?ref=snap
U7 = TLV75533PDBVR:TLV75533PDBVR: Check availability <https://pricing.snapeda.com/parts/TLV75533PDBVR/Texas%20Instruments/view-part?ref=eda>; AVAILABILITY: In Stock; CHECK_PRICES: https://www.snapeda.com/parts/TLV75533PDBVR/Texas+Instruments/view-part/?ref=eda; DESCRIPTION: 500-mA high-PSRR low-IQ low-dropout voltage regulator with enable; MF: Texas Instruments; MP: TLV75533PDBVR; PACKAGE: SOT-23-5 Texas Instruments; PRICE: None; SNAPEDA_LINK: https://www.snapeda.com/parts/TLV75533PDBVR/Texas+Instruments/view-part/?ref=snap
U8 = MKL02Z32VFG4:MKL02Z32VFG4; COPYRIGHT: Copyright (C) 2025 Ultra Librarian. All rights reserved.; MANUFACTURER_PART_NUMBER: MKL02Z32VFG4; MFR_NAME: NXP
U9 = W25Q64JVSSIM:W25Q64JVSSIM: Check availability <https://pricing.snapeda.com/parts/W25Q64JVSSIM/Winbond%20Electronics/view-part?ref=eda>; AVAILABILITY: In Stock; CHECK_PRICES: https://www.snapeda.com/parts/W25Q64JVSSIM/Winbond/view-part/?ref=eda; DESCRIPTION: FLASH - NOR Memory IC 64Mb (8M x 8) SPI - Quad I/O 133 MHz 8-SOIC; MF: Winbond Electronics; MP: W25Q64JVSSIM; PACKAGE: SOIC-8 Winbond Electronics; PRICE: None; SNAPEDA_LINK: https://www.snapeda.com/parts/W25Q64JVSSIM/Winbond/view-part/?ref=snap
U10 = W25N01GVZEIG_TR:W25N01GVZEIG_TR: Check availability <https://pricing.snapeda.com/parts/W25N01GVZEIG%20TR/Winbond%20Electronics/view-part?ref=eda>; AVAILABILITY: In Stock; CHECK_PRICES: https://www.snapeda.com/parts/W25N01GVZEIG%20TR/Winbond/view-part/?ref=eda; DESCRIPTION: FLASH - NAND Memory IC 1Gb (128M x 8) SPI 104 MHz 8-WSON (8x6); MF: Winbond Electronics; MP: W25N01GVZEIG TR; PACKAGE: WSON-8 Winbond; PRICE: None; SNAPEDA_LINK: https://www.snapeda.com/parts/W25N01GVZEIG%20TR/Winbond/view-part/?ref=snap
U$1 = BAT54CTB6:BAT54CTB6
U$2-U$13 = Terminal Blocks:AK100
VR1 = LM7805MPX_NOPB:LM7805MPX/NOPB: Check availability <https://pricing.snapeda.com/parts/LM7805MPX/NOPB/Texas%20Instruments/view-part?ref=eda>; AVAILABILITY: In Stock; CHECK_PRICES: https://www.snapeda.com/parts/LM7805MPX/NOPB/Texas+Instruments/view-part/?ref=eda; DESCRIPTION: 1.5-A, 30-V, linear voltage regulator; MF: Texas Instruments; MP: LM7805MPX/NOPB; PACKAGE: SOT-223-4 Texas Instruments; PRICE: None; SNAPEDA_LINK: https://www.snapeda.com/parts/LM7805MPX/NOPB/Texas+Instruments/view-part/?ref=snap
X1 X2 X4 = adafruit:XTAL: Low cost SMT crystals, no capacitors included http://www.ladyada.net/library/eagle
X3 = con-coax:LTI-SASF54GT: SMA vertical PCB thrue hole jack Source: Lighthorse Technologies, inc. SASF54GT.pdf; OC_FARNELL: unknown; OC_NEWARK: unknown
Y1 = XRCGB24M000F3M00R0:XRCGB24M000F3M00R0: Check availability <https://pricing.snapeda.com/parts/XRCGB24M000F3M00R0/Murata%20Electronics/view-part?ref=eda>; AVAILABILITY: In Stock; CHECK_PRICES: https://www.snapeda.com/parts/XRCGB24M000F3M00R0/Murata+Electronics+North+America/view-part/?ref=eda; DESCRIPTION: 24 MHz ±30ppm Crystal 6pF 150 Ohms 4-SMD, No Lead; MF: Murata Electronics; MP: XRCGB24M000F3M00R0; PACKAGE: SMD-4 Murata; PRICE: None; SNAPEDA_LINK: https://www.snapeda.com/parts/XRCGB24M000F3M00R0/Murata+Electronics+North+America/view-part/?ref=snap